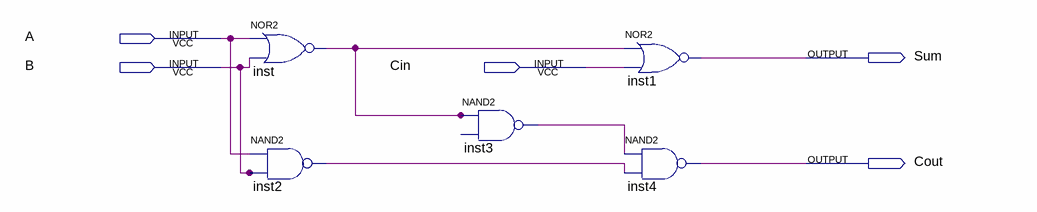
[diagram p0: schematic sheet]
// Quartus schematic Lab2.bdf as structural Verilog: 5 symbols, 5 pins
module Lab2 (
  input  A,
  input  B,
  input  Cin,
  output Sum,
  output Cout
);

  wire inst2_out, inst3_out, inst_out;

  nor inst (inst_out, A, B);
  nand inst2 (inst2_out, A, B);
  not inst3 (inst3_out, inst_out);  // NAND2 open: IN2
  nor inst1 (Sum, inst_out, Cin);
  nand inst4 (Cout, inst3_out, inst2_out);
endmodule
